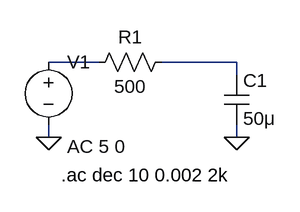
[diagram p0: schematic low_pass_filter.asc]
low_pass_filter.asc, the LTspice schematic file:
Version 4.1
SHEET 1 880 680
WIRE 240 80 176 80
WIRE 416 80 320 80
WIRE 416 96 416 80
WIRE 176 176 176 160
WIRE 416 176 416 160
FLAG 176 176 0
FLAG 416 176 0
SYMBOL cap 400 96 R0
SYMATTR InstName C1
SYMATTR Value 50μ
SYMBOL res 336 64 R90
WINDOW 0 0 56 VBottom 2
WINDOW 3 32 56 VTop 2
SYMATTR InstName R1
SYMATTR Value 500
SYMBOL voltage 176 64 R0
WINDOW 123 24 124 Left 2
WINDOW 39 0 0 Left 0
SYMATTR InstName V1
SYMATTR Value ""
SYMATTR Value2 AC 5 0
TEXT 192 224 Left 2 !.ac dec 10 0.002 2k

The netlist it stands for:
* low_pass_filter.asc
C1 N002 0 50μ
R1 N002 N001 500
V1 N001 0 AC 5 0
.ac dec 10 0.002 2k
.backanno
.end